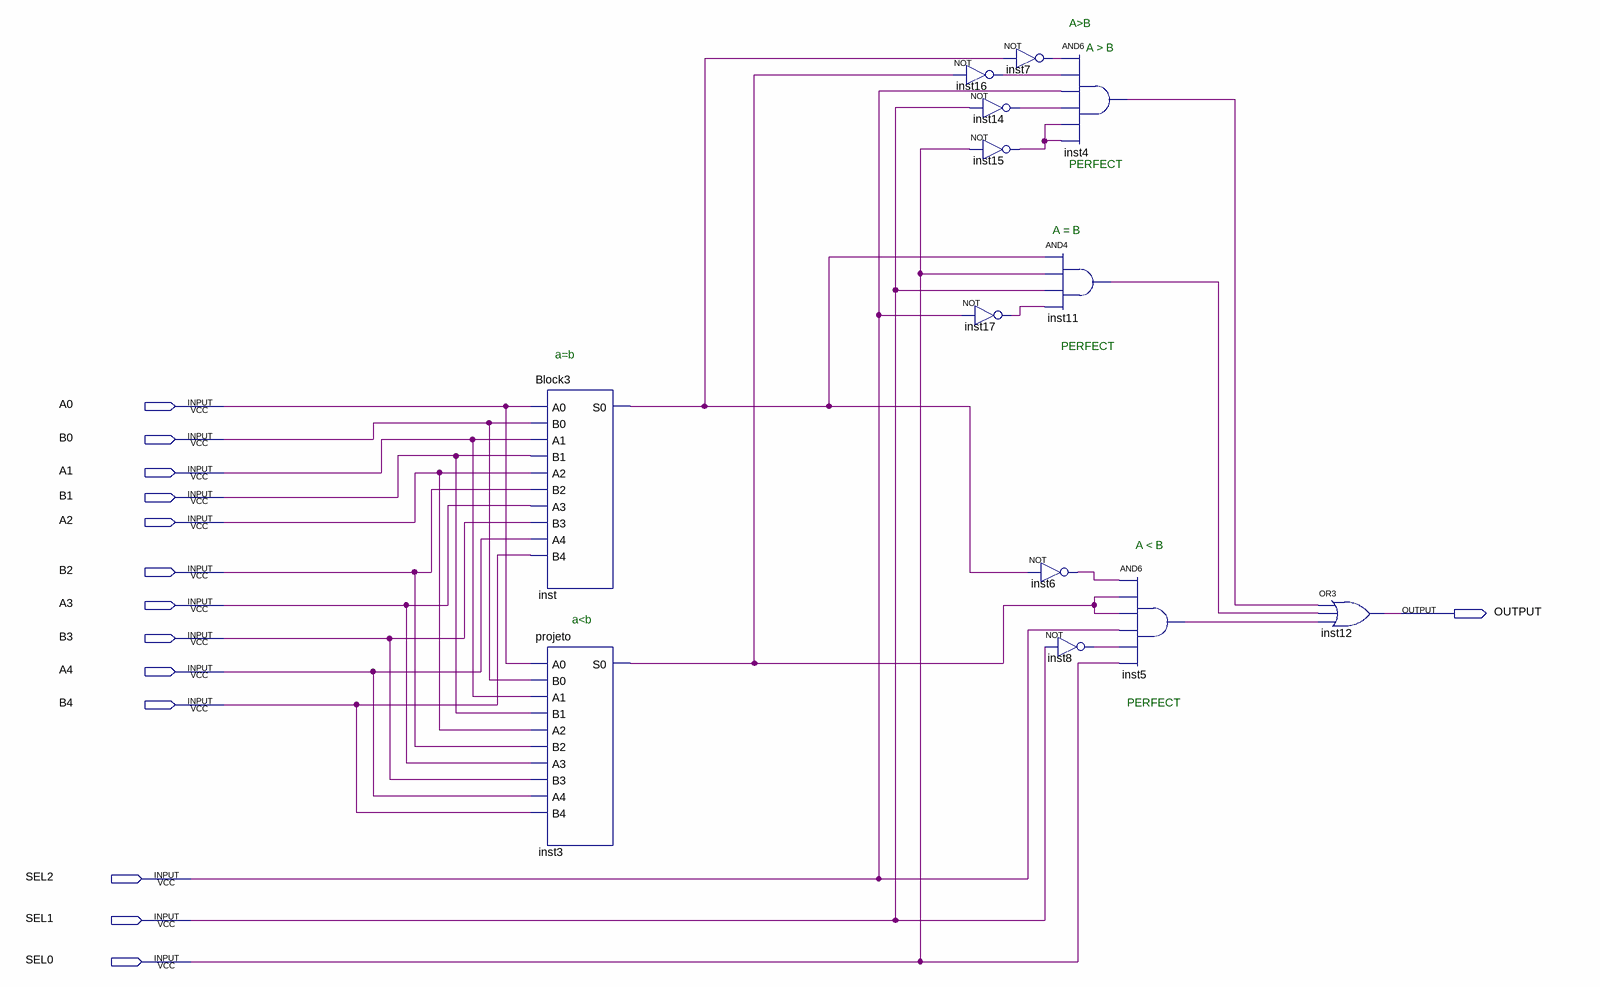
[diagram p0: schematic sheet]
// Quartus schematic Block2.bdf as structural Verilog: 13 symbols, 14 pins
module Block2 (
  input  A0,
  input  B0,
  input  A1,
  input  B1,
  input  A2,
  input  B2,
  input  A3,
  input  B3,
  input  A4,
  input  B4,
  input  SEL2,
  input  SEL1,
  input  SEL0,
  output OUTPUT
);

  wire inst3_s0, inst4_out, inst5_out, inst6_out, inst7_out, inst8_out, inst11_out, inst14_out, inst15_out,
       inst16_out, inst17_out, inst_s0;

  Block3 inst (.A0(A0), .B0(B0), .A1(A1), .B1(B1), .A2(A2), .B2(B2), .A3(A3), .B3(B3), .A4(A4), .B4(B4), .S0(inst_s0));
  projeto inst3 (
    .A0(A0), .B0(B0), .A1(A1), .B1(B1), .A2(A2), .B2(B2), .A3(A3), .B3(B3), .A4(A4), .B4(B4), .S0(inst3_s0));
  not inst16 (inst16_out, inst3_s0);
  not inst14 (inst14_out, SEL1);
  not inst15 (inst15_out, SEL0);
  not inst17 (inst17_out, SEL2);
  not inst7 (inst7_out, inst_s0);
  and inst11 (inst11_out, inst_s0, SEL0, SEL1, inst17_out);
  not inst6 (inst6_out, inst_s0);
  not inst8 (inst8_out, SEL1);
  and inst4 (inst4_out, inst7_out, inst16_out, SEL2, inst14_out, inst15_out, inst15_out);
  and inst5 (inst5_out, inst6_out, inst3_s0, inst3_s0, SEL2, inst8_out, SEL0);
  or inst12 (OUTPUT, inst4_out, inst11_out, inst5_out);

  // Notes on the sheet:
  //   A>B
  //   A > B
  //   PERFECT
  //   A = B
  //   PERFECT
  //   a=b
  //   A < B
  //   a<b
  //   PERFECT
endmodule
